# Altium schematic sheet Sch2.SchDoc
size A3
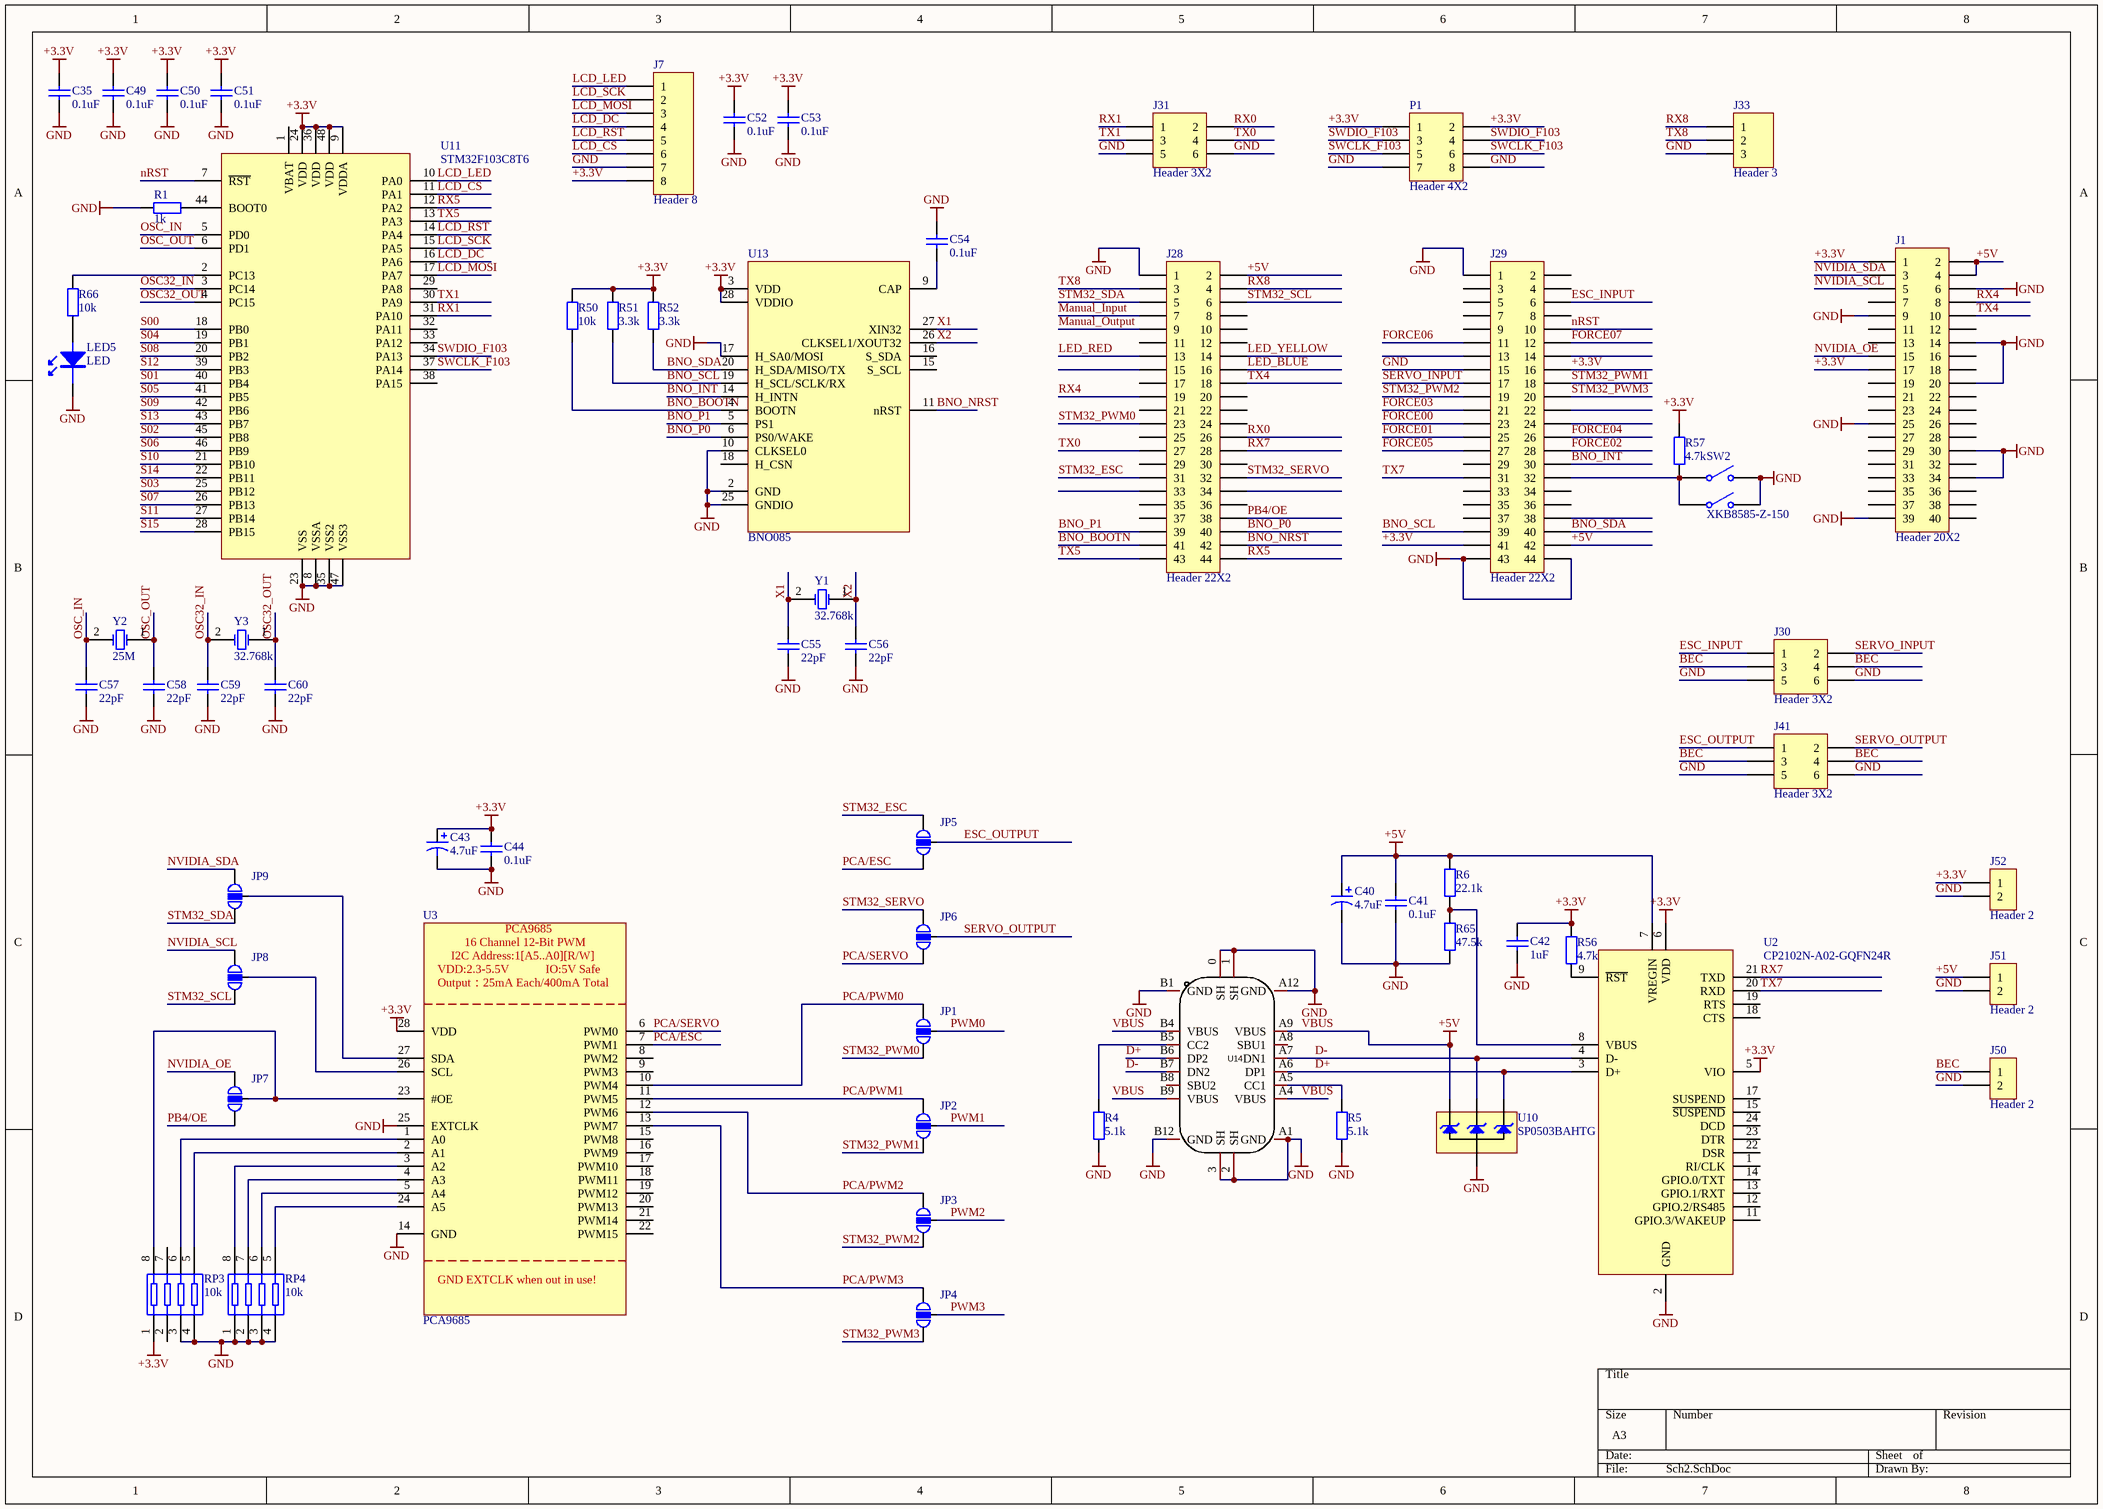
[diagram p0: Sch2.SchDoc]

## Parts
C35  value 0.1uF  [CC0603]  (hidden comment: 0603-50V-0.1uF)
C40  value 4.7uF  [SMD-EC-F5]  (hidden comment: CD-50V-4.7uF-F5(SMD))
C41  value 0.1uF  [CC0603]  (hidden comment: 0603-50V-0.1uF)
C42  value 1uF  [CC0603]  (hidden comment: 0603-50V-1uF)
C43  value 4.7uF  [SMD-EC-F5]  (hidden comment: CD-50V-4.7uF-F5(SMD))
C44  value 0.1uF  [CC0603]  (hidden comment: 0603-50V-0.1uF)
C49  value 0.1uF  [CC0603]  (hidden comment: 0603-50V-0.1uF)
C50  value 0.1uF  [CC0603]  (hidden comment: 0603-50V-0.1uF)
C51  value 0.1uF  [CC0603]  (hidden comment: 0603-50V-0.1uF)
C52  value 0.1uF  [CC0603]  (hidden comment: 0603-50V-0.1uF)
C53  value 0.1uF  [CC0603]  (hidden comment: 0603-50V-0.1uF)
C54  value 0.1uF  [CC0603]  (hidden comment: 0603-50V-0.1uF)
C55  value 22pF  [CC0603]  (hidden comment: 0603-50V-22pF)
C56  value 22pF  [CC0603]  (hidden comment: 0603-50V-22pF)
C57  value 22pF  [CC0603]  (hidden comment: 0603-50V-22pF)
C58  value 22pF  [CC0603]  (hidden comment: 0603-50V-22pF)
C59  value 22pF  [CC0603]  (hidden comment: 0603-50V-22pF)
C60  value 22pF  [CC0603]  (hidden comment: 0603-50V-22pF)
J1  Header 20X2  [HDR2X20]
J7  Header 8  [HDR1X8]
J28  Header 22X2  [HDR2X22]
J29  Header 22X2  [HDR2X22]
J30  Header 3X2  [HDR2X3]
J31  Header 3X2  [HDR2X3]
J33  Header 3  [HDR1X3]
J41  Header 3X2  [HDR2X3]
J50  Header 2  [HDR1X2]
J51  Header 2  [HDR1X2]
J52  Header 2  [HDR1X2]
JP1  Jumper  [HDR1X3]  (value not drawn)
JP2  Jumper  [HDR1X3]  (value not drawn)
JP3  Jumper  [HDR1X3]  (value not drawn)
JP4  Jumper  [HDR1X3]  (value not drawn)
JP5  Jumper  [HDR1X3]  (value not drawn)
JP6  Jumper  [HDR1X3]  (value not drawn)
JP7  Jumper  [HDR1X3]  (value not drawn)
JP8  Jumper  [HDR1X3]  (value not drawn)
JP9  Jumper  [HDR1X3]  (value not drawn)
LED5  value LED  [LED0603]  (hidden comment: 0603-LED-(蓝))
P1  Header 4X2  [HDR2X4]
R1  value 1k  [0603]  (hidden comment: 0603-1kΩ±1％)
R4  value 5.1k  [0603]  (hidden comment: 0603-5.1kΩ±1％)
R5  value 5.1k  [0603]  (hidden comment: 0603-5.1kΩ±1％)
R6  value 22.1k  [0603]  (hidden comment: 0603-22.1kΩ±1％)
R50  value 10k  [0603]  (hidden comment: 0603-10kΩ±1％)
R51  value 3.3k  [0603]  (hidden comment: 0603-3.3kΩ±1％)
R52  value 3.3k  [0603]  (hidden comment: 0603-3.3kΩ±1％)
R56  value 4.7k  [0603]  (hidden comment: 0603-4.7kΩ±1％)
R57  value 4.7k  [0603]  (hidden comment: 0603-4.7kΩ±1％)
R65  value 47.5k  [0603]  (hidden comment: 0603-47.5kΩ±1％)
R66  value 10k  [0603]  (hidden comment: 0603-10kΩ±1％)
RP3  value 10k  [RP8F]  (hidden comment: 0603-10kΩ-2*4P)
RP4  value 10k  [RP8F]  (hidden comment: 0603-10kΩ-2*4P)
SW2  XKB8585-Z-150  [KEY_SWITCH]
U2  CP2102N-A02-GQFN24R  [QFN24]
U3  PCA9685  [TSSOP-28]
U10  SP0503BAHTG  [SOT143-4]
U11  STM32F103C8T6  [LQFP48]
U13  BNO085  [LGA28]
U14  TYPE-C-31-M-12  [USB-C_SMD-TYPE-C-31-M-12]  (value not drawn)
Y1  32.768k  [XTAL-FA135]
Y2  25M  [XT49M]
Y3  32.768k  [XTAL-FA135]

## Nets
+3.3V: C35.2 C42.2 C43.1 C44.2 C49.2 C50.2 C51.2 C52.2 C53.2 J1.1 J1.17 J7.8 J29.16 J29.41 J52.1 P1.1 P1.2 R50.2 R51.2 R52.2 R56.1 R57.1 RP3.1 U2.5(VIO) U2.6(VDD) U3.28(VDD) U11.9(VDDA) U11.24(VDD) U11.36(VDD) U11.48(VDD) U13.3(VDD) U13.28(VDDIO)
+5V: C40.1 C41.2 J1.2 J1.4 J28.2 J29.42 J51.1 R6.1 U2.7(VREGIN) U10.2(K) U14.A4(VBUS) U14.A9(VBUS) U14.B4(VBUS) U14.B9(VBUS)  [also labelled VBUS]
GND: C35.1 C40.2 C41.1 C42.1 C43.2 C44.1 C49.1 C50.1 C51.1 C52.1 C53.1 C54.2 C55.2 C56.2 C57.2 C58.2 C59.2 C60.2 J1.6 J1.9 J1.14 J1.20 J1.25 J1.30 J1.34 J1.39 J7.7 J28.1 J29.1 J29.15 J29.43 J29.44 J30.5 J30.6 J31.5 J31.6 J33.3 J41.5 J41.6 J50.2 J51.2 J52.2 LED5.2 P1.7 P1.8 R1.1 R4.1 R5.1 R65.2 RP3.3 RP3.4 RP4.1 RP4.2 RP4.3 RP4.4 SW2.2(NO) SW2.5(NO) U2.2(GND) U3.14(GND) U3.25(EXTCLK) U10.1(A) U11.8(VSSA) U11.23(VSS) U11.35(VSS2) U11.47(VSS3) U13.2(GND) U13.10(CLKSEL0) U13.17(H_SA0/MOSI) U13.25(GNDIO) U14.0(SH) U14.1(SH) U14.2(SH) U14.3(SH) U14.A1(GND) U14.A12(GND) U14.B1(GND) U14.B12(GND)
BEC: J30.3 J30.4 J41.3 J41.4 J50.1
BNO_BOOTN: J28.41 R50.1 U13.4(BOOTN)
BNO_INT: J29.30 U13.14(H_INTN)
BNO_NRST: J28.42 U13.11(nRST)
BNO_P0: J28.40 U13.6(PS0/WAKE)
BNO_P1: J28.39 U13.5(PS1)
BNO_SCL: J29.39 R51.1 U13.19(H_SCL/SCLK/RX)
BNO_SDA: J29.40 R52.1 U13.20(H_SDA/MISO/TX)
D+: U2.3(D+) U10.4(K) U14.A6(DP1) U14.B6(DP2)
D-: U2.4(D-) U10.3(K) U14.A7(DN1) U14.B7(DN2)
ESC_INPUT: J29.6 J30.1
ESC_OUTPUT: J41.1 JP5.2(B)
FORCE00: J29.23
FORCE01: J29.25
FORCE02: J29.28
FORCE03: J29.21
FORCE04: J29.26
FORCE05: J29.27
FORCE06: J29.11
FORCE07: J29.12
LCD_CS: J7.6 U11.11(PA1)
LCD_DC: J7.4 U11.16(PA6)
LCD_LED: J7.1 U11.10(PA0)
LCD_MOSI: J7.3 U11.17(PA7)
LCD_RST: J7.5 U11.14(PA4)
LCD_SCK: J7.2 U11.15(PA5)
LED_BLUE: J28.16
LED_RED: J28.13
LED_YELLOW: J28.14
Manual_Input: J28.7
Manual_Output: J28.9
nRST: J29.10 U11.7(~{RST})
NVIDIA_OE: J1.15 JP7.1(A)
NVIDIA_SCL: J1.5 JP8.1(A)
NVIDIA_SDA: J1.3 JP9.1(A)
OSC32_IN: C59.1 U11.3(PC14) Y3.2(OSC2)
OSC32_OUT: C60.1 U11.4(PC15) Y3.1(OSC1)
OSC_IN: C57.1 U11.5(PD0) Y2.2(OSC2)
OSC_OUT: C58.1 U11.6(PD1) Y2.1(OSC1)
PB4/OE: J28.38 JP7.3(B)
PCA/ESC: JP5.3(B) U3.7(PWM1)
PCA/PWM0: JP1.1(A) U3.10(PWM4)
PCA/PWM1: JP2.1(A) U3.11(PWM5)
PCA/PWM2: JP3.1(A) U3.12(PWM6)
PCA/PWM3: JP4.1(A) U3.13(PWM7)
PCA/SERVO: JP6.3(B) U3.6(PWM0)
PWM0: JP1.2(B)
PWM1: JP2.2(B)
PWM2: JP3.2(B)
PWM3: JP4.2(B)
RX0: J28.26 J31.2
RX1: J31.1 U11.31(PA10)
RX4: J1.8 J28.19
RX5: J28.44 U11.12(PA2)
RX7: J28.28 U2.21(TXD)
RX8: J28.4 J33.1
S00: U11.18(PB0)
S01: U11.40(PB4)
S02: U11.45(PB8)
S03: U11.25(PB12)
S04: U11.19(PB1)
S05: U11.41(PB5)
S06: U11.46(PB9)
S07: U11.26(PB13)
S08: U11.20(PB2)
S09: U11.42(PB6)
S10: U11.21(PB10)
S11: U11.27(PB14)
S12: U11.39(PB3)
S13: U11.43(PB7)
S14: U11.22(PB11)
S15: U11.28(PB15)
SERVO_INPUT: J29.17 J30.2
SERVO_OUTPUT: J41.2 JP6.2(B)
STM32_ESC: J28.31 JP5.1(A)
STM32_PWM0: J28.23 JP1.3(B)
STM32_PWM1: J29.18 JP2.3(B)
STM32_PWM2: J29.19 JP3.3(B)
STM32_PWM3: J29.20 JP4.3(B)
STM32_SCL: J28.6 JP8.3(B)
STM32_SDA: J28.5 JP9.3(B)
STM32_SERVO: J28.32 JP6.1(A)
SWCLK_F103: P1.5 P1.6 U11.37(PA14)
SWDIO_F103: P1.3 P1.4 U11.34(PA13)
TX0: J28.27 J31.4
TX1: J31.3 U11.30(PA9)
TX4: J1.10 J28.18
TX5: J28.43 U11.13(PA3)
TX7: J29.31 U2.20(RXD)
TX8: J28.3 J33.2
X1: C55.1 U13.27(XIN32) Y1.2(OSC2)
X2: C56.1 U13.26(CLKSEL1/XOUT32) Y1.1(OSC1)
NetC54_1: C54.1 U13.9(CAP)
NetJ29_32: J29.32 R57.2 SW2.1(COMMON) SW2.6(COMMON)
NetJP7_2: JP7.2(B) RP3.8 U3.23(#OE)
NetJP8_2: JP8.2(B) U3.26(SCL)
NetJP9_2: JP9.2(B) U3.27(SDA)
NetLED5_1: LED5.1 R66.1
NetR1_2: R1.2 U11.44(BOOT0)
NetR4_2: R4.2 U14.B5(CC2)
NetR5_2: R5.2 U14.A5(CC1)
NetR6_2: R6.2 R65.1 U2.8(VBUS)
NetR56_2: R56.2 U2.9(~{RST})
NetR66_2: R66.2 U11.2(PC13)
NetRP3_5: RP3.5 U3.2(A1)
NetRP3_6: RP3.6 U3.1(A0)
NetRP4_5: RP4.5 U3.24(A5)
NetRP4_6: RP4.6 U3.5(A4)
NetRP4_7: RP4.7 U3.4(A3)
NetRP4_8: RP4.8 U3.3(A2)

Not connected (* = marked no-connect by the designer): J1 7 11 12 13 16 18 19 21 22 23 24 26 27 28 29 31 32 33 35 36 37 38 40; J28 8 10 11 12 15 17 20 21 22 24 25 29 30 33 34 35 36 37; J29 2 3 4 5 7 8 9 13 14 22 24 29 33 34 35 36 37 38; RP3 2 7; U2 1(RI/CLK) 11(GPIO.3/WAKEUP) 12(GPIO.2/RS485) 13(GPIO.1/RXT) 14(GPIO.0/TXT) 15(~{SUSPEND}) 17(SUSPEND) 18(CTS) 19(RTS) 22(DSR) 23(DTR) 24(DCD); U3 8(PWM2) 9(PWM3) 15(PWM8) 16(PWM9) 17(PWM10) 18(PWM11) 19(PWM12) 20(PWM13) 21(PWM14) 22(PWM15); U11 1(VBAT) 29(PA8) 32(PA11) 33(PA12) 38(PA15); U13 15(S_SCL) 16(S_SDA) 18(H_CSN); U14 A8(SBU1) B8(SBU2)

## Notes on the sheet
- (in symbol PCA9685) 16 Channel 12-Bit PWM; I2C Address:1[A5..A0][R/W]; VDD:2.3-5.5V; IO:5V Safe; Output：25mA Each/400mA Total; GND EXTCLK when out in use!

## Library data of the parts
C35 C41 C42 C44 C49-C60 = Cap: 贴片电容
C40 C43 = Cap Pol1: 贴片铝电解电容
J1 = Header 20X2: 排针; Value: 2.54mm 2x8P双排针
J7 = Header 8: 排针; Value: 2.54mm 8P单排针
J28 J29 = Header 22X2: 排针; Value: 2.54mm 2x22P双排针
J30 J31 = Header 3X2: 排针; Value: 2.54mm 2x3P双排针
J33 = Header 3: 排针; Value: 2.54mm 3P单排针
J41 = Header 3X2: 排针; Value: 2.54mm 2x8P双排针
J50-J52 = CON2: 排针; Value: 2.54mm 2P单排针
JP1-JP9 = Bell: Value: 2.54mm 3P单排针
LED5 = LED: 发光二极管
P1 = Header 4X2: 排针; Value: 2.54mm 2x4P双排针
R1 R4-R6 R50-R52 R56 R57 R65 R66 = Res2: 贴片电阻
RP3 RP4 = RESPACK: 排阻
SW2 = SW-SPST: 开关; Value: XKB8585-Z-150
U2 = CP2102N-A02-GQFN24R: 集成电路; Value: CP2102N-A02-GQFN24R
U3 = PCA9685: 集成电路; Value: PCA9685
U10 = SP0503BAHTG: 集成电路; Value: SP0503BAHTG
U11 = STM32F103C8T6: 集成电路; Value: STM32F103C8T6
U13 = BNO080: 集成电路; Value: BNO085
U14 = TYPE-C-31-M-12: Manufacturer: 韩国韩荣; Add into BOM: yes; Connector Type: Type-C; Gender: 母座; Number of Contacts: 16P; Number of Ports: 1; Current Rating - Power (Max): 5A; Name: TYPE-C-31-M-12; Symbol: TYPE-C-31-M-12; Device: TYPE-C-31-M-12; LCSC Part Name: Type-C 母座; Supplier Part: C165948; Manufacturer Part: TYPE-C-31-M-12; Supplier Footprint: SMD; JLCPCB Part Class: Extended Part; Datasheet: https://atta.szlcsc.com/upload/public/pdf/source/20220525/466408E853115E789EDB0DDC29077C05.pdf; Supplier: LCSC; Convert to PCB: yes; Standard: -; Mounting Style: -; Contact Material: -; Contact Plating: -; Operating Temperature Range: -; Welding Temperature (Max): -
Y1-Y3 = XTAL: Crystal Oscillator; Published: 8-Jun-2000; LatestRevisionDate: 17-Jul-2002; LatestRevisionNote: Re-released for DXP Platform.; PackageReference: R38; Publisher: Altium Limited; PackageDescription: Crystal, Thru-Hole; 2 Leads; Body 3.1 x 8.2 mm (Dia.xH)